# EAGLE design omca_to_mega_1 (EAGLE 7.6.0)
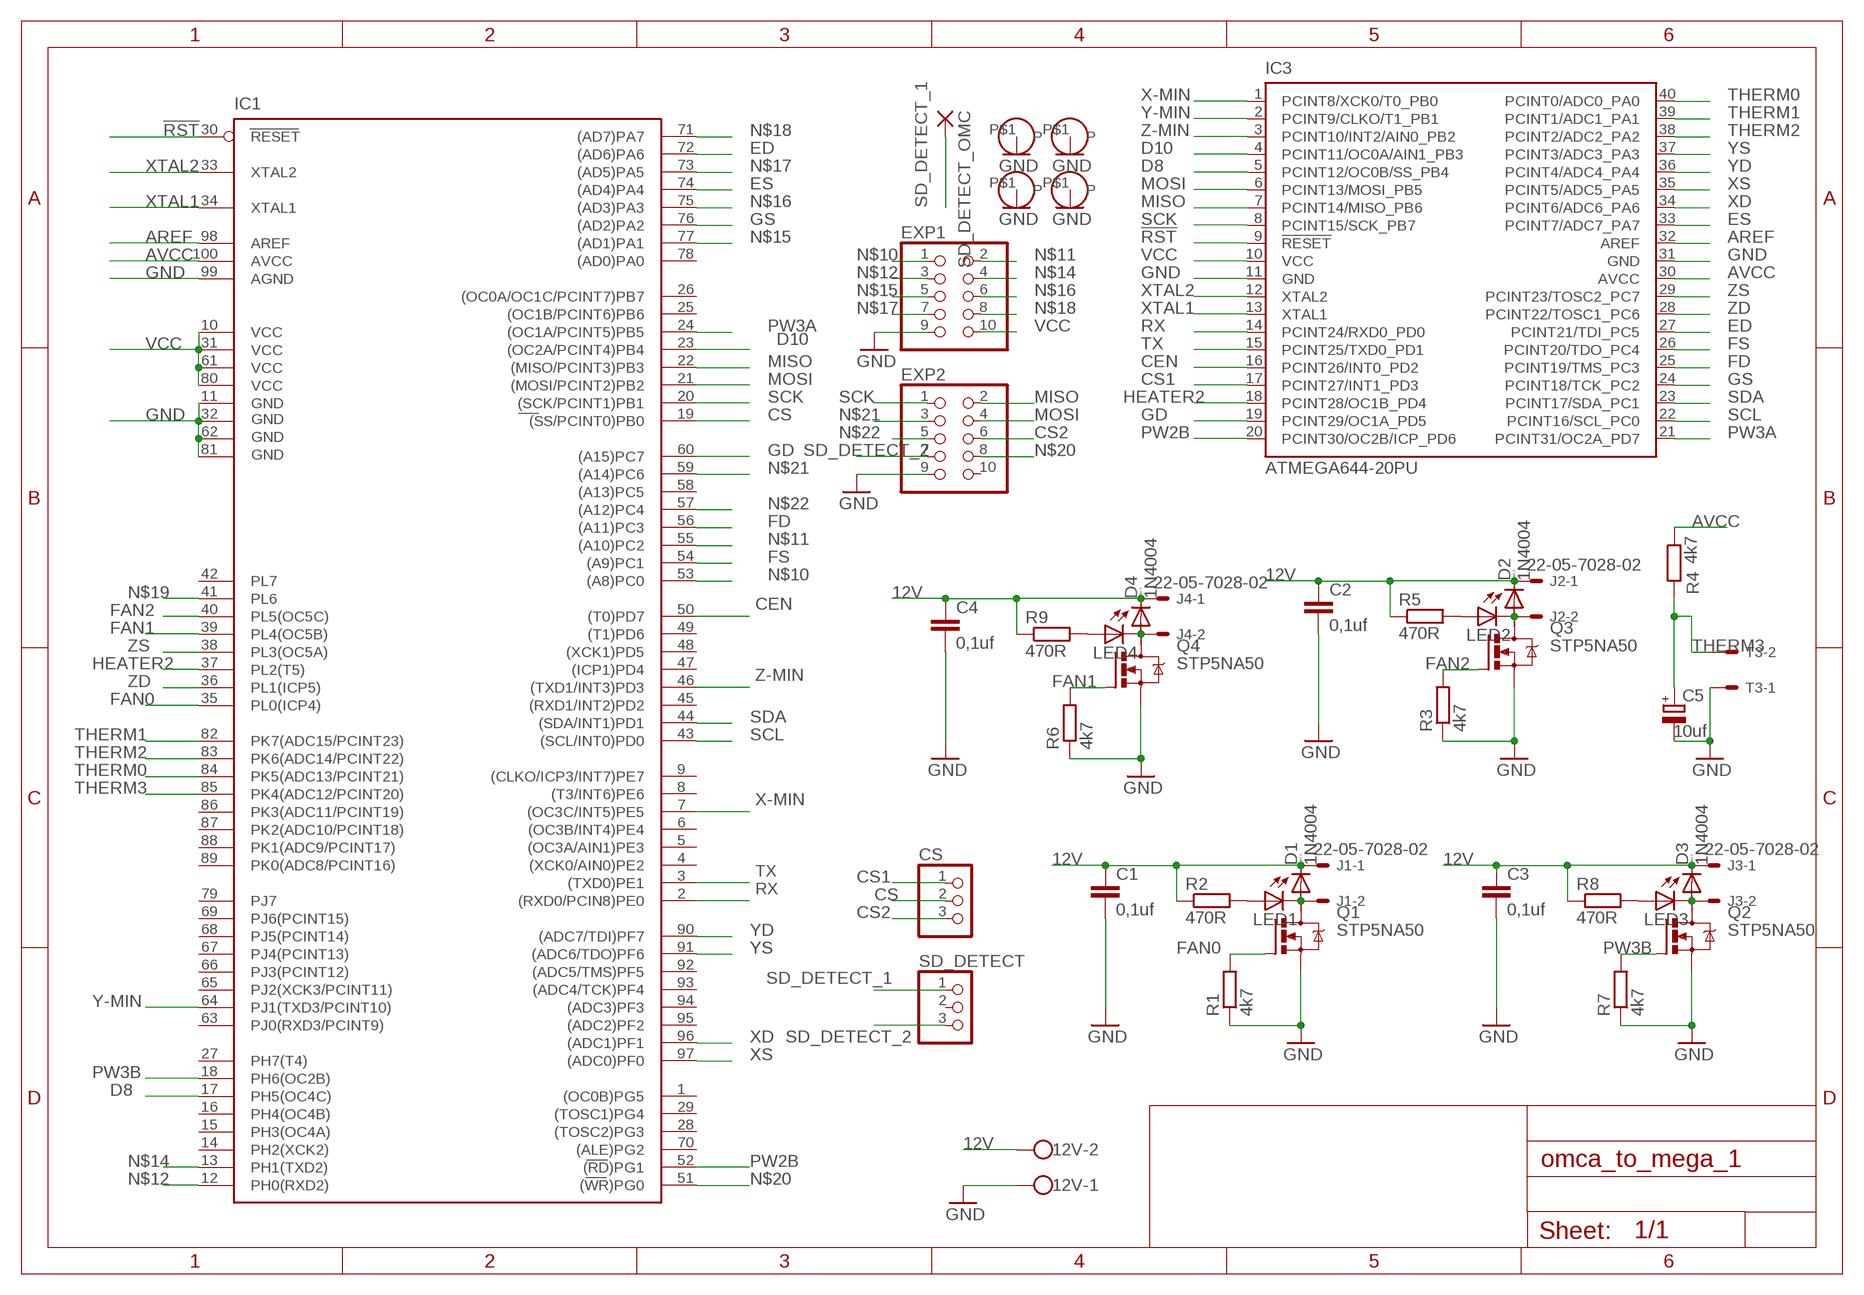
[diagram p0: schematic, sheet 1]

## Parts
12V  W237-102  [W237-102]
C1  0,1uf  C-EU025-024X044  [C025-024X044]
C2  0,1uf  C-EU025-024X044  [C025-024X044]
C3  0,1uf  C-EU025-024X044  [C025-024X044]
C4  0,1uf  C-EU025-024X044  [C025-024X044]
C5  10uf  CPOL-EUTT2D4  [TT2D4]
CS  PINHD-1X3  [1X03]
D1  1N4004  DIODE-D-7.5  [D-7.5]
D2  1N4004  DIODE-D-7.5  [D-7.5]
D3  1N4004  DIODE-D-7.5  [D-7.5]
D4  1N4004  DIODE-D-7.5  [D-7.5]
EXP1  PINHD-2X5  [2X05]
EXP2  PINHD-2X5  [2X05]
IC1  ATMEGA2560-16AU  ATMEGA25602560-16AU  [TQFP100]
IC3  ATMEGA644-20PU  [DIL40]
J1  22-05-7028-02  [7395-02]
J2  22-05-7028-02  [7395-02]
J3  22-05-7028-02  [7395-02]
J4  22-05-7028-02  [7395-02]
LED1  LED3MM  [LED3MM]
LED2  LED3MM  [LED3MM]
LED3  LED3MM  [LED3MM]
LED4  LED3MM  [LED3MM]
Q1  STP5NA50  [TO220BV]
Q2  STP5NA50  [TO220BV]
Q3  STP5NA50  [TO220BV]
Q4  STP5NA50  [TO220BV]
R1  4k7  R-EU_0204/7  [0204/7]
R2  470R  R-EU_0204/7  [0204/7]
R3  4k7  R-EU_0204/7  [0204/7]
R4  4k7  R-EU_0204/7  [0204/7]
R5  470R  R-EU_0204/7  [0204/7]
R6  4k7  R-EU_0204/7  [0204/7]
R7  4k7  R-EU_0204/7  [0204/7]
R8  470R  R-EU_0204/7  [0204/7]
R9  470R  R-EU_0204/7  [0204/7]
SD_DETECT  PINHD-1X3  [1X03]
SD_DETECT_OMC  1,6/0,8  [1,6/0,8]
T3  22-05-7028-02  [7395-02]
U$2  HOLE  [HOLE]
U$3  HOLE  [HOLE]
U$4  HOLE  [HOLE]
U$5  HOLE  [HOLE]

## Nets
12V: 12V.2 C1.1 C2.1 C3.1 C4.1 D1.C D2.C D3.C D4.C J1.1 J2.1 J3.1 J4.1 R2.1 R5.1 R8.1 R9.1
!RST: IC1.30(RESET) IC3.9(!RESET)
AREF: IC1.98(AREF) IC3.32(AREF)
AVCC: IC1.100(AVCC) IC3.30(AVCC) R4.1
CEN: IC1.50((T0)PD7) IC3.16(PCINT26/INT0_PD2)
CS: CS.2 IC1.19((SS/PCINT0)PB0)
CS1: CS.1 IC3.17(PCINT27/INT1_PD3)
CS2: CS.3 EXP2.6
D8: IC1.17(PH5(OC4C)) IC3.5(PCINT12/OC0B/SS_PB4)
D10: IC1.23((OC2A/PCINT4)PB4) IC3.4(PCINT11/OC0A/AIN1_PB3)
ED: IC1.72((AD6)PA6) IC3.27(PCINT21/TDI_PC5)
ES: IC1.74((AD4)PA4) IC3.33(PCINT7/ADC7_PA7)
FAN0: IC1.35(PL0(ICP4)) Q1.G R1.2
FAN1: IC1.39(PL4(OC5B)) Q4.G R6.2
FAN2: IC1.40(PL5(OC5C)) Q3.G R3.2
FD: IC1.56((A11)PC3) IC3.25(PCINT19/TMS_PC3)
FS: IC1.54((A9)PC1) IC3.26(PCINT20/TDO_PC4)
GD: IC1.60((A15)PC7) IC3.19(PCINT29/OC1A_PD5)
GND: 12V.1 C1.2 C2.2 C3.2 C4.2 C5.- EXP1.9 EXP2.9 IC1.11(GND) IC1.32(GND1) IC1.62(GND2) IC1.81(GND3) IC1.99(AGND) IC3.11(GND) IC3.31(GND) Q1.S Q2.S Q3.S Q4.S R1.1 R3.1 R6.1 R7.1 T3.1 U$2.P$1(P) U$3.P$1(P) U$4.P$1(P) U$5.P$1(P)
GS: IC1.76((AD2)PA2) IC3.24(PCINT18/TCK_PC2)
HEATER2: IC1.37(PL2(T5)) IC3.18(PCINT28/OC1B_PD4)
MISO: EXP2.2 IC1.22((MISO/PCINT3)PB3) IC3.7(PCINT14/MISO_PB6)
MOSI: EXP2.4 IC1.21((MOSI/PCINT2)PB2) IC3.6(PCINT13/MOSI_PB5)
N$2: D1.A J1.2 LED1.K(C) Q1.D
N$3: LED1.A R2.2
N$5: D2.A J2.2 LED2.K(C) Q3.D
N$6: LED2.A R5.2
N$8: D4.A J4.2 LED4.K(C) Q4.D
N$9: LED4.A R9.2
N$10: EXP1.1 IC1.53((A8)PC0)
N$11: EXP1.2 IC1.55((A10)PC2)
N$12: EXP1.3 IC1.12(PH0(RXD2))
N$13: D3.A J3.2 LED3.K(C) Q2.D
N$14: EXP1.4 IC1.13(PH1(TXD2))
N$15: EXP1.5 IC1.77((AD1)PA1)
N$16: EXP1.6 IC1.75((AD3)PA3)
N$17: EXP1.7 IC1.73((AD5)PA5)
N$18: EXP1.8 IC1.71((AD7)PA7)
N$19: IC1.41(PL6)
N$20: EXP2.8 IC1.51((WR)PG0)
N$21: EXP2.3 IC1.59((A14)PC6)
N$22: EXP2.5 IC1.57((A12)PC4)
N$52: LED3.A R8.2
PW2B: IC1.52((RD)PG1) IC3.20(PCINT30/OC2B/ICP_PD6)
PW3A: IC1.24((OC1A/PCINT5)PB5) IC3.21(PCINT31/OC2A_PD7)
PW3B: IC1.18(PH6(OC2B)) Q2.G R7.2
RX: IC1.2((RXD0/PCIN8)PE0) IC3.14(PCINT24/RXD0_PD0)
SCK: EXP2.1 IC1.20((SCK/PCINT1)PB1) IC3.8(PCINT15/SCK_PB7)
SCL: IC1.43((SCL/INT0)PD0) IC3.22(PCINT16/SCL_PC0)
SD_DETECT_1: SD_DETECT.1 SD_DETECT_OMC.1(P)
SD_DETECT_2: EXP2.7 SD_DETECT.3
SDA: IC1.44((SDA/INT1)PD1) IC3.23(PCINT17/SDA_PC1)
THERM0: IC1.84(PK5(ADC13/PCINT21)) IC3.40(PCINT0/ADC0_PA0)
THERM1: IC1.82(PK7(ADC15/PCINT23)) IC3.39(PCINT1/ADC1_PA1)
THERM2: IC1.83(PK6(ADC14/PCINT22)) IC3.38(PCINT2/ADC2_PA2)
THERM3: C5.+ IC1.85(PK4(ADC12/PCINT20)) R4.2 T3.2
TX: IC1.3((TXD0)PE1) IC3.15(PCINT25/TXD0_PD1)
VCC: EXP1.10 IC1.10(VCC) IC1.31(VCC1) IC1.61(VCC2) IC1.80(VCC3) IC3.10(VCC)
X-MIN: IC1.7((OC3C/INT5)PE5) IC3.1(PCINT8/XCK0/T0_PB0)
XD: IC1.96((ADC1)PF1) IC3.34(PCINT6/ADC6_PA6)
XS: IC1.97((ADC0)PF0) IC3.35(PCINT5/ADC5_PA5)
XTAL1: IC1.34(XTAL1) IC3.13(XTAL1)
XTAL2: IC1.33(XTAL2) IC3.12(XTAL2)
Y-MIN: IC1.64(PJ1(TXD3/PCINT10)) IC3.2(PCINT9/CLKO/T1_PB1)
YD: IC1.90((ADC7/TDI)PF7) IC3.36(PCINT4/ADC4_PA4)
YS: IC1.91((ADC6/TDO)PF6) IC3.37(PCINT3/ADC3_PA3)
Z-MIN: IC1.46((TXD1/INT3)PD3) IC3.3(PCINT10/INT2/AIN0_PB2)
ZD: IC1.36(PL1(ICP5)) IC3.28(PCINT22/TOSC1_PC6)
ZS: IC1.38(PL3(OC5A)) IC3.29(PCINT23/TOSC2_PC7)
Unconnected: EXP2.10 IC1.1((OC0B)PG5) IC1.4((XCK0/AIN0)PE2) IC1.5((OC3A/AIN1)PE3) IC1.6((OC3B/INT4)PE4) IC1.8((T3/INT6)PE6) IC1.9((CLKO/ICP3/INT7)PE7) IC1.14(PH2(XCK2)) IC1.15(PH3(OC4A)) IC1.16(PH4(OC4B)) IC1.25((OC1B/PCINT6)PB6) IC1.26((OC0A/OC1C/PCINT7)PB7) IC1.27(PH7(T4)) IC1.28((TOSC2)PG3) IC1.29((TOSC1)PG4) IC1.42(PL7) IC1.45((RXD1/INT2)PD2) IC1.47((ICP1)PD4) IC1.48((XCK1)PD5) IC1.49((T1)PD6) IC1.58((A13)PC5) IC1.63(PJ0(RXD3/PCINT9)) IC1.65(PJ2(XCK3/PCINT11)) IC1.66(PJ3(PCINT12)) IC1.67(PJ4(PCINT13)) IC1.68(PJ5(PCINT14)) IC1.69(PJ6(PCINT15)) IC1.70((ALE)PG2) IC1.78((AD0)PA0) IC1.79(PJ7) IC1.86(PK3(ADC11/PCINT19)) IC1.87(PK2(ADC10/PCINT18)) IC1.88(PK1(ADC9/PCINT17)) IC1.89(PK0(ADC8/PCINT16)) IC1.92((ADC5/TMS)PF5) IC1.93((ADC4/TCK)PF4) IC1.94((ADC3)PF3) IC1.95((ADC2)PF2) SD_DETECT.2

## Library data of the parts
12V = con-wago-500:W237-102: WAGO SCREW CLAMP; MPN: 237-102; OC_FARNELL: unknown; OC_NEWARK: 70K9898
C1-C4 = resistor:C-EU: CAPACITOR, European symbol; MF: VISHAY; MPN: K104K15X7RF53L2; OC_FARNELL: 1141775
C5 = rcl:CPOL-EU: POLARIZED CAPACITOR, European symbol; MF: RUBYCON; MPN: 100YXF10MEFC6.3X11; OC_FARNELL: 1144640
CS SD_DETECT = pinhead:PINHD-1X3: PIN HEADER
D1-D4 = diode:DIODE-: DIODE; MF: ON SEMICONDUCTOR; MPN: 1N4004RL; OC_FARNELL: 9556109
EXP1 EXP2 = pinhead:PINHD-2X5: PIN HEADER
IC1 = SmartPrj:ATMEGA2560: MICROCONTROLLER 64/128/256 Kbytes FLASH 4 Kbytes EEPROM 8 Kbytes SRAM 86 General Purpose I/O pins 12-channels16-bit PWM 4 x Serial USARTs 16-channels 10-bit A/D
IC3 = atmel:ATMEGA644-*PU: 8-bit Microcontroller with 64K Bytes In-System Programmable Flash Auto generated by make-symbol-device-package-bsdl.ulp Rev. 34 Source: http://www.atmel.com/dyn/resources/prod_documents/doc2593.pdf; MF: ATMEL; MPN: ATMEGA644-20PU; OC_FARNELL: 1288340; OC_NEWARK: 23M5060
J1-J4 T3 = con-molex:22-?-02: CONNECTOR wire to board 2.54 mm (.1 inch) pitch header; MF: MOLEX; MPN: 22-05-7028; OC_FARNELL: 9731601; OC_NEWARK: unknown
LED1-LED4 = led:LED: LED OSRAM: - CHIPLED LG R971, LG N971, LY N971, LG Q971, LY Q971, LO R971, LY R971 LH N974, LH R974 LS Q976, LO Q976, LY Q976 LO Q996 - Hyper CHIPLED LW Q18S LB Q993, LB Q99A, LB R99A - SideLED LS A670, LO A670, LY A670, LG A670, LP A670 LB A673, LV A673, LT A673, LW A673 LH A674 LY A675 LS A676, LA A676, LO A676, LY A676, LW A676 LS A679, LY A679, LG A679 - Hyper Micro SIDELED® LS Y876, LA Y876, LO Y876, LY Y876 LT Y87S - SmartLED LW L88C, LW L88S LB L89C, LB L89S, LG L890 LS L89K, LO L89K, LY L89K LS L896, LA L896, LO L896, LY L896 - TOPLED LS T670, LO T670, LY T670, LG T670, LP T670 LSG T670, LSP T670, LSY T670, LOP T670, LYG T670 LG T671, LOG T671, LSG T671 LB T673, LV T673, LT T673, LW T673 LH T674 LS T676, LA T676, LO T676, LY T676, LB T676, LH T676, LSB T676, LW T676 LB T67C, LV T67C, LT T67C, LS T67K, LO T67K, LY T67K, LW E67C LS E67B, LA E67B, LO E67B, LY E67B, LB E67C, LV E67C, LT E67C LW T67C LS T679, LY T679, LG T679 LS T770, LO T770, LY T770, LG T770, LP T770 LB T773, LV T773, LT T773, LW T773 LH T774 LS E675, LA E675, LY E675, LS T675 LS T776, LA T776, LO T776, LY T776, LB T776 LHGB T686 LT T68C, LB T68C - Hyper Mini TOPLED® LB M676 - Mini TOPLED Santana® LG M470 LS M47K, LO M47K, LY M47K Source: http://www.osram.convergy.de LUXEON: - LUMILED® LXK2-PW12-R00, LXK2-PW12-S00, LXK2-PW14-U00, LXK2-PW14-V00 LXK2-PM12-R00, LXK2-PM12-S00, LXK2-PM14-U00 LXK2-PE12-Q00, LXK2-PE12-R00, LXK2-PE12-S00, LXK2-PE14-T00, LXK2-PE14-U00 LXK2-PB12-K00, LXK2-PB12-L00, LXK2-PB12-M00, LXK2-PB14-N00, LXK2-PB14-P00, LXK2-PB14-Q00 LXK2-PR12-L00, LXK2-PR12-M00, LXK2-PR14-Q00, LXK2-PR14-R00 LXK2-PD12-Q00, LXK2-PD12-R00, LXK2-PD12-S00 LXK2-PH12-R00, LXK2-PH12-S00 LXK2-PL12-P00, LXK2-PL12-Q00, LXK2-PL12-R00 Source: www.luxeon.com KINGBRIGHT: KA-3528ASYC Source: www.kingbright.com; MF: KINGBRIGHT; MPN: L-93WEYW; OC_FARNELL: 1142521
Q1-Q4 = transistor-power:STP5NA50: N-CHANNEL MOS FET; MF: STMICROELECTRONICS; MPN: STP55NF06L.; OC_FARNELL: 1783902
R1 R3 R6 R7 = resistor:R-EU_: RESISTOR, European symbol; MF: WELWYN; MPN: MFR4 10K 1%; OC_FARNELL: 1099988
R2 R5 R8 R9 = resistor:R-EU_: RESISTOR, European symbol; MF: WELWYN; MPN: MFR4 470R 1%; OC_FARNELL: 1099883
R4 = rcl:R-EU_: RESISTOR, European symbol; MF: WELWYN; MPN: MFR4 4K7 1%; OC_FARNELL: 1099979
SD_DETECT_OMC = wirepad:1,6/0,8: THROUGH-HOLE PAD
U$2-U$5 = amino:HOLE; OC_FARNELL: unknown

## Net classes
0 default: width 0.61 mm

## Board
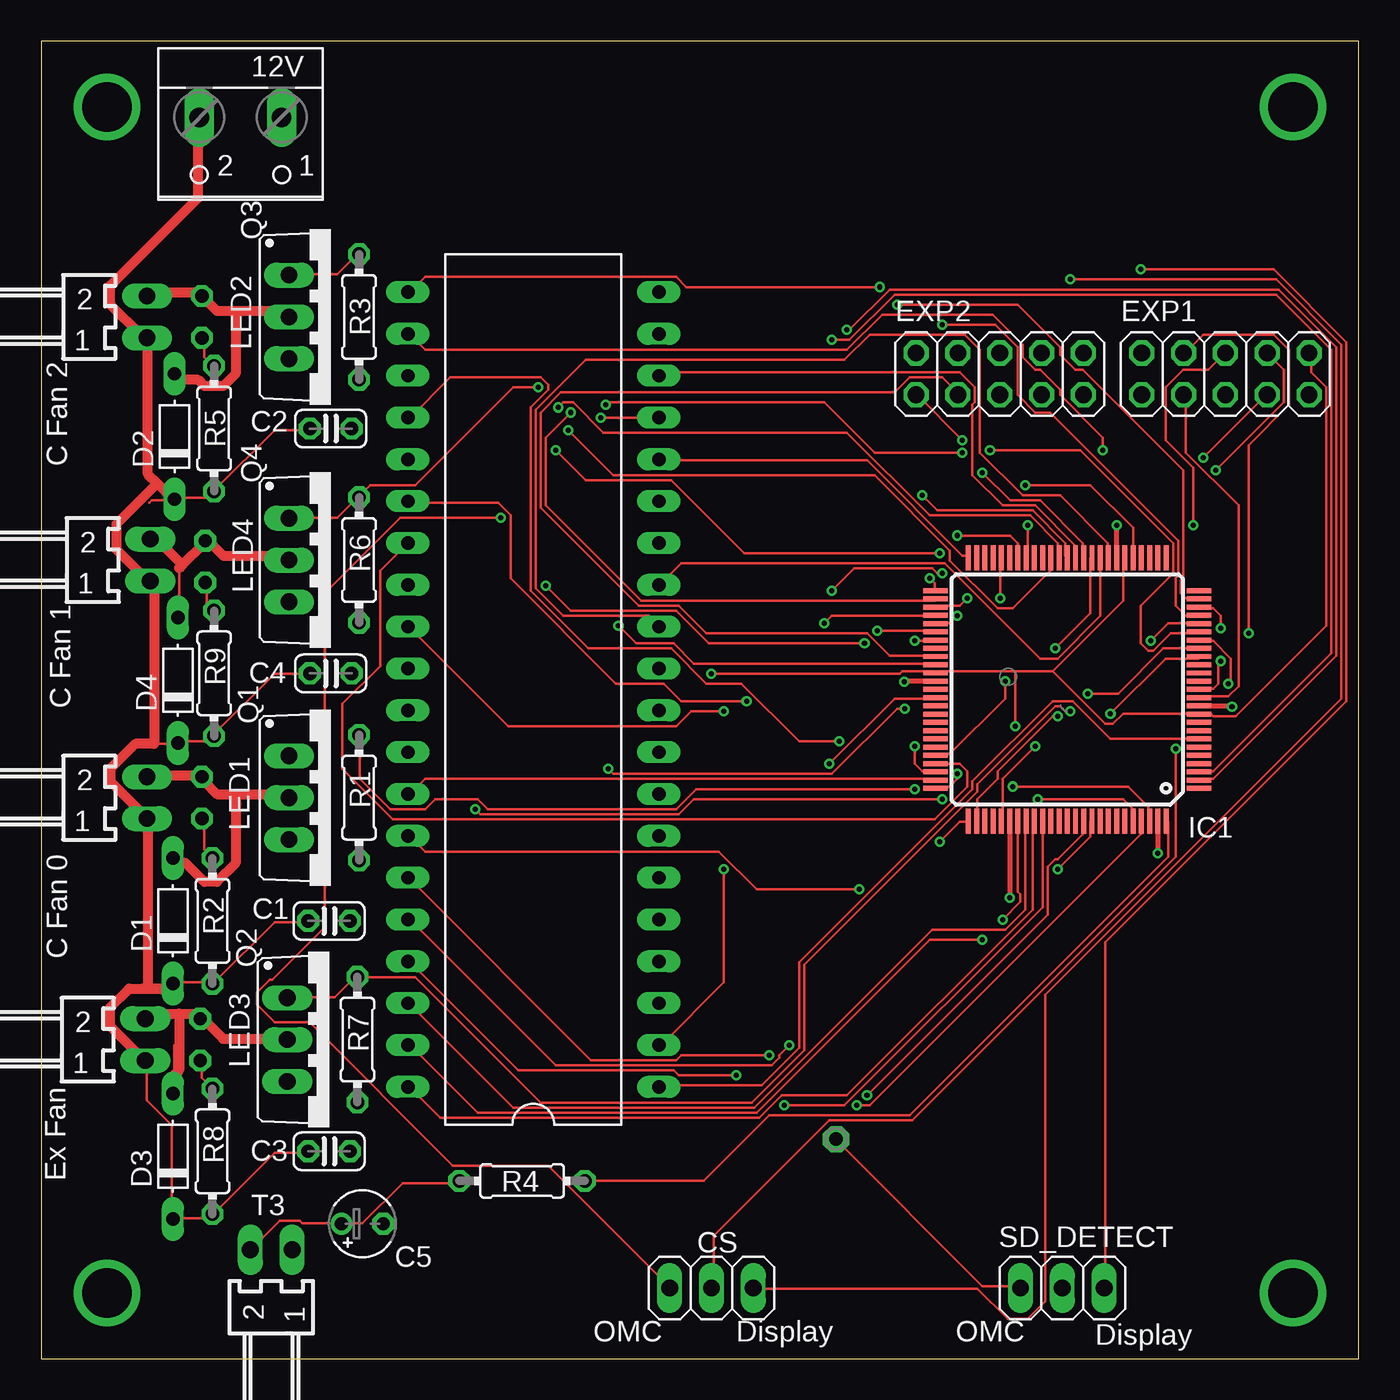
[diagram p1: board, top side]
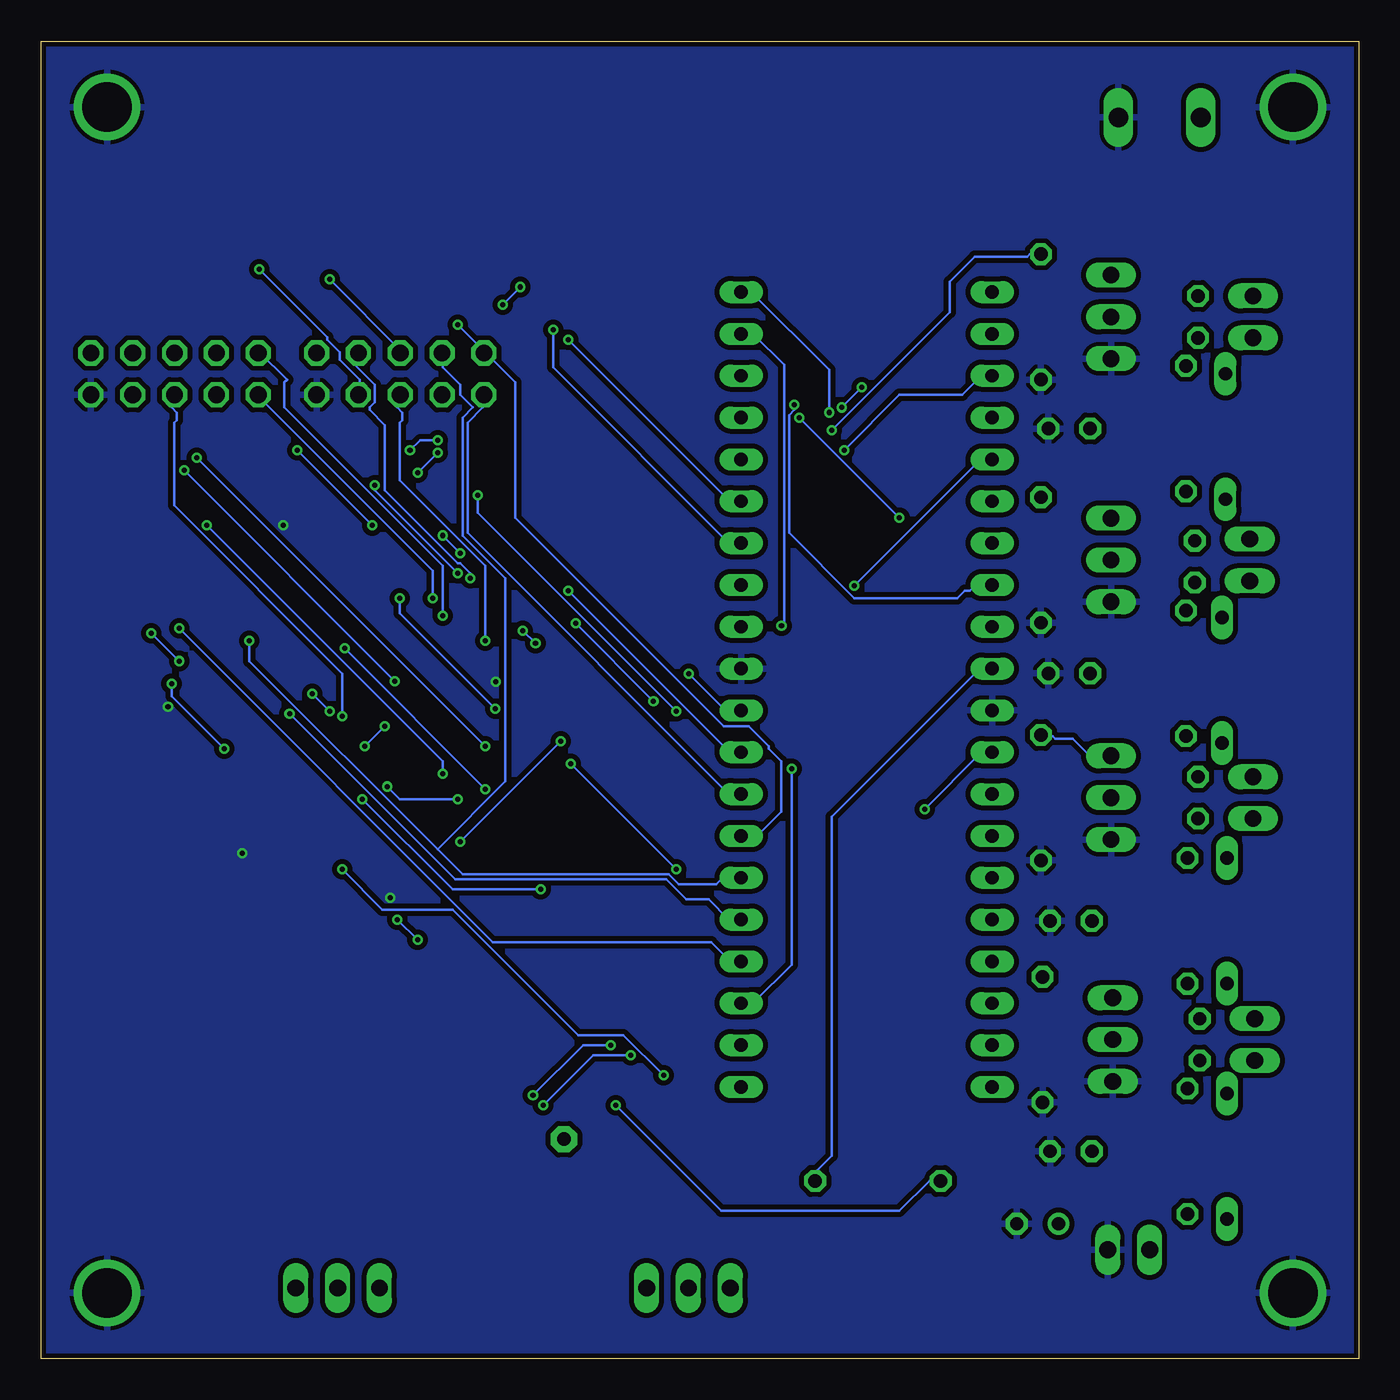
[diagram p2: board, bottom side, seen from below]

Size 80 x 80 mm. Coordinates in mm from the lower left corner, seen from the top.
Outline: 0,0 80,0 80,80 0,80 0,0
Copper layers (1*16): Top 0.035mm / dielectric 1.5mm / Bottom 0.035mm
Design rules "default *": minimum track width 6mil, minimum drill 12mil, track to track 6mil, track to pad 6mil, pad to pad 6mil, via to via 6mil, smd to smd 0mil, copper to edge 10mil, drill to drill 10mil, minimum pad ring 10mil, minimum via ring 6mil, stop-mask expansion 2mil, vias tented up to drill 100mil, thermal gap 10mil

### Footprints (pad centres in the part's own frame; a part is rotated, then mirrored left to right if it is on the bottom)
W237-102 = drill 1.194 long: 1 -2.5,-1.27; 2 2.5,-1.27
C025-024X044 = drill 0.813 octagon: 1 -1.27,0; 2 1.27,0
TT2D4 = drill 0.813: + -1.27,0 | drill 0.813 octagon: - 1.27,0
1X03 = drill 1.016 long: 1 -2.54,0; 2 0,0; 3 2.54,0
D-7.5 = drill 0.813 long: A 3.81,0; C -3.81,0
2X05 = drill 1.016 octagon: 1 -5.08,-1.27; 2 -5.08,1.27; 3 -2.54,-1.27; 4 -2.54,1.27; 5 0,-1.27; 6 0,1.27; 7 2.54,-1.27; 8 2.54,1.27; 9 5.08,-1.27; 10 5.08,1.27
TQFP100 = smd 1.5 x 0.3: 1 -8,6; 2 -8,5.5; 3 -8,5; 4 -8,4.5; 5 -8,4; 6 -8,3.5; 7 -8,3; 8 -8,2.5; 9 -8,2; 10 -8,1.5; 11 -8,1; 12 -8,0.5; 13 -8,0; 14 -8,-0.5; 15 -8,-1; 16 -8,-1.5; 17 -8,-2; 18 -8,-2.5; 19 -8,-3; 20 -8,-3.5; 21 -8,-4; 22 -8,-4.5; 23 -8,-5; 24 -8,-5.5; 25 -8,-6; 51 8,-6; 52 8,-5.5; 53 8,-5; 54 8,-4.5; 55 8,-4; 56 8,-3.5; 57 8,-3; 58 8,-2.5; 59 8,-2; 60 8,-1.5; 61 8,-1; 62 8,-0.5; 63 8,0; 64 8,0.5; 65 8,1; 66 8,1.5; 67 8,2; 68 8,2.5; 69 8,3; 70 8,3.5; 71 8,4; 72 8,4.5; 73 8,5; 74 8,5.5; 75 8,6 | smd 0.3 x 1.5: 26 -6,-8; 27 -5.5,-8; 28 -5,-8; 29 -4.5,-8; 30 -4,-8; 31 -3.5,-8; 32 -3,-8; 33 -2.5,-8; 34 -2,-8; 35 -1.5,-8; 36 -1,-8; 37 -0.5,-8; 38 0,-8; 39 0.5,-8; 40 1,-8; 41 1.5,-8; 42 2,-8; 43 2.5,-8; 44 3,-8; 45 3.5,-8; 46 4,-8; 47 4.5,-8; 48 5,-8; 49 5.5,-8; 50 6,-8; 76 6,8; 77 5.5,8; 78 5,8; 79 4.5,8; 80 4,8; 81 3.5,8; 82 3,8; 83 2.5,8; 84 2,8; 85 1.5,8; 86 1,8; 87 0.5,8; 88 0,8; 89 -0.5,8; 90 -1,8; 91 -1.5,8; 92 -2,8; 93 -2.5,8; 94 -3,8; 95 -3.5,8; 96 -4,8; 97 -4.5,8; 98 -5,8; 99 -5.5,8; 100 -6,8
DIL40 = drill 0.813 long: 1 -24.13,-7.62; 2 -21.59,-7.62; 3 -19.05,-7.62; 4 -16.51,-7.62; 5 -13.97,-7.62; 6 -11.43,-7.62; 7 -8.89,-7.62; 8 -6.35,-7.62; 9 -3.81,-7.62; 10 -1.27,-7.62; 11 1.27,-7.62; 12 3.81,-7.62; 13 6.35,-7.62; 14 8.89,-7.62; 15 11.43,-7.62; 16 13.97,-7.62; 17 16.51,-7.62; 18 19.05,-7.62; 19 21.59,-7.62; 20 24.13,-7.62; 21 24.13,7.62; 22 21.59,7.62; 23 19.05,7.62; 24 16.51,7.62; 25 13.97,7.62; 26 11.43,7.62; 27 8.89,7.62; 28 6.35,7.62; 29 3.81,7.62; 30 1.27,7.62; 31 -1.27,7.62; 32 -3.81,7.62; 33 -6.35,7.62; 34 -8.89,7.62; 35 -11.43,7.62; 36 -13.97,7.62; 37 -16.51,7.62; 38 -19.05,7.62; 39 -21.59,7.62; 40 -24.13,7.62
7395-02 = drill 1.016 long: 1 1.27,0; 2 -1.27,0
LED3MM = drill 0.813 octagon: A -1.27,0; K 1.27,0
TO220BV = drill 1.016 long: D 0,-2.54; G -2.54,-2.54; S 2.54,-2.54
0204/7 = drill 0.813 octagon: 1 -3.81,0; 2 3.81,0
1,6/0,8 = drill 0.813 pad 1.6 octagon: 1 0,0
HOLE = drill 3: P$1 0,0

### Placement (x,y rotation side)
12V  12.1,74.1 180 top
C1  17.48,26.59 0 top
C2  17.58,56.48 0 top
C3  17.48,12.6 0 top
C4  17.58,41.62 0 top
C5  19.5,8.2 0 top
CS  40.7,4.3 0 top
D1  8,26.59 90 top
D2  8.1,56 90 top
D3  8,12.3 90 top
D4  8.3,41.2 90 top
EXP1  71.9,59.8 0 top
EXP2  58.2,59.8 0 top
IC1  62.3,40.64 180 top
IC3  29.88,40.64 90 top
J1  6.42,34.07 270 top
J2  6.42,63.26 270 top
J3  6.32,19.38 270 top
J4  6.62,48.5 270 top
LED1  9.76,34.07 90 top
LED2  9.76,63.26 90 top
LED3  9.66,19.38 90 top
LED4  9.96,48.4 90 top
Q1  17.58,34.07 270 top
Q2  17.48,19.38 270 top
Q3  17.58,63.26 270 top
Q4  17.58,48.5 270 top
R1  19.3,34.07 90 top
R2  10.4,26.59 90 top
R3  19.3,63.26 90 top
R4  29.2,10.8 180 top
R5  10.5,56.48 90 top
R6  19.3,48.5 90 top
R7  19.2,19.38 90 top
R8  10.4,12.6 90 top
R9  10.5,41.62 90 top
SD_DETECT  62,4.3 0 top
SD_DETECT_OMC  48.26,13.34 0 top
T3  13.97,6.62 0 top
U$2  4,4 0 top
U$3  4,76 0 top
U$4  76,76 0 top
U$5  76,4 0 top

### Tracks (layer width: path | path; a pad name or v marks a point on that pad's centre or on a via)
12V
  Top 0.152: C3.1 16.15,12.5 14.17,12.5 10.52,8.84 R8.1 10.36,8.69 10.21,8.53 8.08,8.53 D3.C 7.92,8.53 7.92,14.17 6.4,15.7 6.4,17.98 J3.1 6.25,18.14 | C1.1 16.15,26.52 14.17,26.52 10.52,22.86 R2.1 10.36,22.86 8.08,22.86 D1.C 7.92,22.71 6.1,22.71 | C4.1 16.31,41.6 14.17,41.6 10.52,37.95 R9.1 10.36,37.8 10.06,37.49 8.38,37.49 D4.C 8.23,37.34 6.86,37.34 6.71,37.34 | C2.1 16.31,56.39 14.17,56.39 10.52,52.73 R5.1 10.36,52.58 10.06,52.27 8.23,52.27 D2.C 8.08,52.12 6.71,52.12 6.55,51.97
  Top 0.61: 6.48,22.48 5.33,22.48 4.19,21.34 4.19,20.19 6.1,18.29 J3.1 | 6.48,22.48 7.62,22.48 D1.C | 7.05,53.15 8,52.2 D2.C | 7.05,53.15 6.48,53.72 6.48,61.72 J2.1 6.1,62.1 4.19,64.01 4.19,65.15 9.53,70.48 9.53,75.06 12V.2 | 7.05,53.15 4.57,50.67 4.57,49.15 6.48,47.24 J4.1 6.86,46.86 6.86,37.34 5.71,37.34 4.19,35.81 4.19,35.05 6.1,33.15 J1.1 6.48,32.77 6.48,22.48
!RST  (via drill 0.3)
  Top 0.152: v59.74,53.03 63.7,53.03 66.29,50.44 66.29,48.77 IC1.30 | v54.71,47.7 54.41,47.7 54.1,48.01 49.38,48.01 v48.01,46.63
  Bottom 0.152: v59.74,53.03 59.74,52.73 v54.71,47.7 | v48.01,46.63 38.25,36.88 37.64,36.88 IC3.9
AREF  (via drill 0.3)
  Top 0.152: v58.98,34.75 65.99,34.75 67.21,33.53 67.21,32.77 IC1.98 | v54.71,33.98 39.62,33.98 38.71,33.07 26.67,33.07 v26.36,33.38
  Bottom 0.152: v58.98,34.75 58.22,33.98 v54.71,33.98 | v26.36,33.38 23.01,36.73 22.4,36.73 IC3.32
AVCC
  Top 0.152: IC1.100 68.43,32.61 68.43,30.48 52.73,14.78 44.2,14.78 40.23,10.82 33.07,10.82 R4.1
  Bottom 0.152: IC3.30 23.01,41.91 32,32.92 32,12.34 32.92,11.43 32.92,10.82 R4.1
CEN
  Top 0.152: IC1.50 56.24,48.77 55.93,48.77 50.14,54.56 37.64,54.56 IC3.16
CS  (via drill 0.3)
  Top 0.152: v72.08,41 72.24,41.15 72.24,42.52 71.17,43.59 70.41,43.59 IC1.19 | v68.89,37.03 68.89,30.48 52.88,14.48 47.85,14.48 40.84,7.47 40.84,4.42 CS.2
  Bottom 0.152: v72.08,41 72.08,40.23 v68.89,37.03
CS1  (via drill 0.3)
  Top 0.152: v33.98,57.15 IC3.17 | v27.89,51.05 21.79,51.05 17.22,46.48 17.22,26.21 14.02,23.01 13.87,23.01 13.11,22.25 13.11,21.49 14.17,20.42 16.31,20.42 24.99,11.73 30.79,11.73 38.1,4.42 CS.1
  Bottom 0.152: v27.89,51.05 v33.98,57.15
CS2  (via drill 0.3)
  Top 0.152: v62.48,65.53 74.98,65.53 78.94,61.57 78.94,40.08 60.96,22.1 60.96,3.5 59.89,2.44 58.67,2.44 56.84,4.27 43.28,4.27 CS.3
  Bottom 0.152: v62.48,65.53 58.06,61.11 EXP2.6
D8  (via drill 0.3)
  Top 0.152: v64.92,39.17 68.28,42.52 70.26,42.52 IC1.17
  Bottom 0.152: v64.92,39.17 54.86,29.11 42.06,29.11 40.84,27.89 39.47,27.89 38.25,26.67 IC3.5
D10  (via drill 0.3)
  Top 0.152: v71.63,44.35 71.63,45.11 71.17,45.57 70.41,45.57 IC1.23
  Bottom 0.152: v71.63,44.35 52.58,25.3 39.32,25.3 38.25,24.23 37.64,24.23 IC3.4
ED
  Top 0.152: IC1.72 54.41,36.12 55.78,36.12 56.24,35.66 56.24,34.75 54.25,32.77 21.34,32.77 18.29,35.81 18.29,39.78 20.57,42.06 20.57,47.85 IC3.27
ES
  Top 0.152: IC1.74 54.25,35.2 23.32,35.2 22.4,34.29 IC3.33
FAN0  (via drill 0.3)
  Top 0.152: v61.57,43.13 63.7,45.26 63.7,48.62 IC1.35 | v53.03,34.59 39.78,34.59 38.56,33.38 27.13,33.38 26.52,33.98 23.93,33.98 23.32,33.38 21.18,33.38 19.36,35.2 19.36,37.8 R1.2
  Bottom 0.152: v53.03,34.59 v61.57,43.13 | Q1.G 15.09,36.73 16.46,36.73 17.37,37.64 18.44,37.64 18.59,37.8 19.2,37.8 R1.2
FAN1  (via drill 0.3)
  Top 0.152: v31.39,57.76 31.7,58.06 32.31,58.06 34.14,56.24 48.92,56.24 53.95,51.21 60.05,51.21 61.72,49.53 61.72,48.77 IC1.39 | v30.18,58.98 28.65,58.98 22.71,53.03 19.96,53.03 19.36,52.43 R6.2 19.2,52.27 17.98,51.05 15.09,51.05 Q4.G
  Bottom 0.152: v30.18,58.98 v31.39,57.76
FAN2  (via drill 0.3)
  Top 0.152: v32,56.39 34.75,53.65 50.6,53.65 55.17,49.07 55.17,48.46 58.06,45.57 58.98,45.57 61.27,47.85 61.27,48.62 IC1.40 | Q3.G 15.09,65.84 17.98,65.84 19.2,67.06 R3.2
  Bottom 0.152: v32,56.39 24.84,63.55 24.84,65.38 23.32,66.9 20.12,66.9 19.96,67.06 19.36,67.06 R3.2
FD  (via drill 0.3)
  Top 0.152: v50.75,44.2 54.25,44.2 IC1.56 | v49.99,43.43 40.54,43.43 38.56,45.41 32.16,45.41 v30.63,46.94
  Bottom 0.152: v49.99,43.43 v50.75,44.2 | v30.63,46.94 23.01,54.56 22.4,54.56 IC3.25
FS  (via drill 0.3)
  Top 0.152: v47.55,44.65 48.01,45.11 54.25,45.11 IC1.54 | v42.82,39.93 38.86,39.93 37.8,41 34.9,41 28.5,47.4 28.5,51.21 27.74,51.97 22.4,51.97 IC3.26
  Bottom 0.152: v42.82,39.93 v47.55,44.65
GD  (via drill 0.3)
  Top 0.152: v35.05,44.5 36.12,43.43 38.41,43.43 39.62,42.22 54.25,42.22 IC1.60
  Bottom 0.152: v35.05,44.5 34.9,44.65 34.9,60.35 36.73,62.18 37.49,62.18 IC3.19
GND  (via drill 0.3)
  Top 0.305: IC1.62 52.4,41.14 | IC1.81 v58.8,28 | IC1.99 v67.8,30.7 | IC1.11 72.3,39.64 | IC1.32 v65.3,50.6
  Top 0.406: 52.4,41.14 v52.4,41.1 | 72.3,39.64 v72.3,39.6
  pour Bottom (isolate 0.305): 0,80 80,80 80,0 0,0
GS  (via drill 0.3)
  Top 0.152: v54.56,31.39 55.78,32.61 56.24,32.61 IC1.76 | v48.46,37.49 46.02,37.49 42.52,41 40.39,41 38.25,43.13 33.22,43.13 29.72,46.63 29.72,57.76 30.79,58.83 30.79,59.13 30.33,59.59 24.84,59.59 22.4,57.15 IC3.24
  Bottom 0.152: v48.46,37.49 v54.56,31.39
HEATER2
  Top 0.152: IC1.37 62.79,48.77 62.79,49.38 60.35,51.82 58.37,51.82 56.54,53.65 56.54,57.91 56.69,58.06 56.69,58.98 55.78,59.89 37.8,59.89 37.64,59.74 IC3.18
MISO  (via drill 0.3)
  Top 0.152: v54.71,62.79 57.91,62.79 59.28,61.42 59.28,58.52 60.35,57.45 61.27,57.45 69.04,49.68 69.04,47.55 68.89,47.4 68.89,45.72 69.49,45.11 70.26,45.11 IC1.22
  Bottom 0.152: 53.03,61.11 v54.71,62.79 | 53.03,61.11 51.21,59.28 51.21,51.05 38.56,38.41 37.03,38.41 35.81,37.19 35.81,37.03 35.05,36.27 35.05,33.22 36.42,31.85 37.49,31.85 IC3.7 | 53.03,61.11 EXP2.2
MOSI  (via drill 0.3)
  Top 0.152: v67.36,43.59 68.43,44.65 70.26,44.65 IC1.21
  Bottom 0.152: v67.36,43.59 67.36,42.37 55.93,30.94 | 55.93,30.94 54.41,29.41 41.91,29.41 41.3,28.8 39.01,28.8 38.71,29.11 37.64,29.11 IC3.6 | 55.93,30.94 51.82,35.05 51.82,47.4 54.41,49.99 54.41,57.15 53.8,57.76 54.56,58.52 54.56,59.13 55.63,60.2 55.63,60.96 EXP2.4
N$2
  Top 0.152: 8.08,30.48 D1.A
  Top 0.61: J1.2 6.48,35.43 9.53,35.43 LED1.K 9.91,35.05 10.67,34.29 11.81,34.29 | 11.81,34.29 14.86,34.29 Q1.D | 11.81,34.29 11.81,30.1 10.67,28.96 9.91,28.96 8.76,30.1 8,30.1 D1.A
N$3
  Top 0.152: LED1.A 9.91,32.77 9.91,30.94 10.36,30.48 R2.2
N$5
  Top 0.152: 8.23,59.89 D2.A
  Top 0.61: J2.2 6.48,64.77 9.53,64.77 LED2.K 9.91,64.39 10.67,63.63 11.81,63.63 | 11.81,63.63 14.86,63.63 Q3.D | 11.81,63.63 11.81,59.82 11.05,59.05 9.91,59.05 9.53,59.44 8.38,59.44 D2.A
N$6
  Top 0.152: LED2.A 9.91,61.87 9.91,60.81 10.36,60.35 R5.2
N$8
  Top 0.152: 8.38,48.01 8.38,45.11 D4.A
  Top 0.61: 8.38,48.01 8.57,48.2 | 8.57,48.2 9.91,49.53 LED4.K 10.29,49.53 11.05,48.77 14.86,48.77 Q4.D | 8.57,48.2 6.86,49.91 J4.2
N$9
  Top 0.152: LED4.A 10.06,47.09 10.06,45.87 10.36,45.57 R9.2
N$10  (via drill 0.3)
  Top 0.152: v56.24,46.18 55.78,45.72 54.41,45.72 IC1.53
  Bottom 0.152: v56.24,46.18 56.24,47.85 66.9,58.52 EXP1.1
N$11  (via drill 0.3)
  Top 0.152: v55.63,45.11 55.17,44.65 54.41,44.65 IC1.55
  Bottom 0.152: v55.63,45.11 55.63,48.16 65.23,57.76 65.23,59.28 65.08,59.44 66.75,61.11 EXP1.2
N$12
  Top 0.152: IC1.12 70.41,40.23 72.08,40.23 72.69,40.84 72.69,51.82 69.49,55.02 69.49,58.52 EXP1.3
N$13
  Top 0.152: 8.08,19.05 8.08,16.15 D3.A
  Top 0.61: 8.38,20.95 6.48,20.95 J3.2 | 8.38,20.95 9.53,20.95 LED3.K 9.91,20.57 11.05,19.43 14.86,19.43 Q2.D | 8.38,20.95 8.38,17.53 8,17.14 8,16.38 D3.A
N$14  (via drill 0.3)
  Top 0.152: v71.63,42.37 71.48,42.22 71.48,41 71.17,40.69 70.41,40.69 IC1.13 | v73.3,44.04 73.3,55.47 75.74,57.91 75.74,61.27 74.83,62.18 70.56,62.18 69.49,61.11 EXP1.4
  Bottom 0.152: v73.3,44.04 v71.63,42.37
N$15  (via drill 0.3)
  Top 0.152: v61.72,39.01 61.42,39.01 58.06,35.66 58.06,35.2 56.84,33.98 56.84,32.77 IC1.77
  Bottom 0.152: v61.72,39.01 61.72,41.6 71.93,51.82 71.93,56.84 71.78,57 71.78,57.45 72.08,57.76 72.08,58.37 71.93,58.52 EXP1.5
N$16  (via drill 0.3)
  Top 0.152: v55.63,35.51 55.63,35.2 55.17,34.75 54.41,34.75 IC1.75 | v69.95,50.6 69.95,54.1 68.28,55.78 68.28,58.98 69.34,60.05 70.87,60.05 71.78,60.96 EXP1.6
  Bottom 0.152: v55.63,35.51 55.63,36.27 v69.95,50.6
N$17  (via drill 0.3)
  Top 0.152: v53.03,37.19 53.03,36.12 53.49,35.66 54.25,35.66 IC1.73 | v70.56,54.71 74.37,58.52 EXP1.7
  Bottom 0.152: v70.56,54.71 v53.03,37.19
N$18  (via drill 0.3)
  Top 0.152: v58.52,41.15 58.52,40.08 55.17,36.73 54.41,36.73 IC1.71 | v71.32,53.95 75.44,58.06 75.44,60.05 74.52,60.96 EXP1.8
  Bottom 0.152: v71.32,53.95 v58.52,41.15
N$20  (via drill 0.3)
  Top 0.152: v53.95,47.4 54.25,47.09 54.25,46.79 IC1.51
  Bottom 0.152: v53.95,47.4 53.95,47.7 54.56,48.31 54.71,48.31 59.13,52.73 59.13,56.69 60.05,57.61 60.05,57.76 59.74,58.06 59.74,59.13 60.96,60.35 60.96,60.81 60.81,60.96 EXP2.8
N$21
  Top 0.152: IC1.59 54.25,42.67 51.51,42.67 50.14,44.04 40.39,44.04 38.71,45.72 36.27,45.72 30.33,51.66 30.33,57.45 31.55,58.67 51.82,58.67 52.73,59.59 54.71,59.59 55.63,58.67 EXP2.3
N$22  (via drill 0.3)
  Top 0.152: v53.03,43.59 54.25,43.59 IC1.57
  Bottom 0.152: v53.03,43.59 53.03,48.16 58.22,53.34 58.22,56.84 58.06,57 58.06,57.45 58.37,57.76 58.37,58.37 58.22,58.52 EXP2.5
N$52
  Top 0.152: LED3.A 9.75,17.98 9.75,17.07 10.36,16.46 R8.2
PW2B  (via drill 0.3)
  Top 0.152: v32.16,57.45 30.63,55.93 30.63,51.82 36.42,46.02 54.25,46.02 IC1.52
  Bottom 0.152: v32.16,57.45 32.16,60.05 36.88,64.77 IC3.20
PW3A  (via drill 0.3)
  Top 0.152: v51.97,64.01 59.28,64.01 61.87,61.42 61.87,60.96 62.79,60.05 63.25,60.05 69.34,53.95 69.34,47.4 69.19,47.24 69.19,46.48 69.49,46.18 70.26,46.18 IC1.24 | v50.9,65.08 39.17,65.08 38.56,65.68 23.32,65.68 22.4,64.77 IC3.21
  Bottom 0.152: v50.9,65.08 v51.97,64.01
PW3B  (via drill 0.3)
  Top 0.152: v63.55,40.39 65.38,40.39 68.12,43.13 70.26,43.13 IC1.18 | v62.48,39.32 62.18,39.32 61.87,39.62 61.57,39.62 56.84,34.9 56.84,34.44 46.33,23.93 46.33,18.75 43.13,15.54 30.33,15.54 22.71,23.16 19.2,23.16 R7.2 19.05,23.16 17.83,21.95 15.09,21.95 Q2.G
  Bottom 0.152: v62.48,39.32 v63.55,40.39
RX  (via drill 0.3)
  Top 0.152: v48.92,62.48 49.07,62.48 51.51,64.92 75.13,64.92 78.64,61.42 78.64,42.67 71.17,35.2 70.41,35.2 IC1.2
  Bottom 0.152: v48.92,62.48 48.92,60.2 38.25,49.53 IC3.14
SCK  (via drill 0.3)
  Top 0.152: v57.61,55.17 63.09,55.17 68.73,49.53 68.73,47.7 66.75,45.72 66.75,43.43 67.21,42.98 67.51,42.98 68.58,44.04 70.26,44.04 IC1.20 | v55.93,55.78 53.19,58.52 EXP2.1
  Bottom 0.152: v57.61,55.17 57,55.78 v55.93,55.78 | IC3.8 38.25,34.29 54.1,50.14 54.1,56.84 53.19,57.76 53.19,58.52 EXP2.1
SCL  (via drill 0.3)
  Top 0.152: v59.89,50.6 59.89,48.77 IC1.43 | v64.47,55.17 64.47,55.93 61.87,58.52 61.87,58.83 60.66,60.05 60.35,60.05 59.59,60.81 59.59,61.57 57.76,63.4 51.05,63.4 48.92,61.27 23.32,61.27 22.4,62.18 IC3.22
  Bottom 0.152: v64.47,55.17 v59.89,50.6
SD_DETECT_1
  Top 0.152: SD_DETECT.1 59.44,4.42 57.15,4.42 48.31,13.26 SD_DETECT_OMC.1
SD_DETECT_2  (via drill 0.3)
  Top 0.152: v66.75,66.14 74.83,66.14 79.25,61.72 79.25,39.93 64.62,25.3 64.62,4.42 SD_DETECT.3
  Bottom 0.152: v66.75,66.14 62.64,62.03 62.64,61.87 61.87,61.11 61.87,60.66 60.66,59.44 60.66,58.67 EXP2.7
SDA  (via drill 0.3)
  Top 0.152: v55.63,49.99 58.83,49.99 59.28,49.53 59.28,48.77 IC1.44 | v54.56,48.92 42.67,48.92 38.25,53.34 33.07,53.34 v31.24,55.17
  Bottom 0.152: v54.56,48.92 v55.63,49.99 | v31.24,55.17 27.89,58.52 24.08,58.52 23.01,59.59 22.4,59.59 IC3.23
THERM0
  Top 0.152: IC1.84 60.2,32.61 60.2,27.28 48.92,16 44.96,16 43.59,14.63 24.23,14.63 22.4,16.46 IC3.40
THERM1  (via drill 0.3)
  Top 0.152: v58.37,26.67 59.44,27.74 59.44,28.19 59.28,28.35 59.28,32.61 IC1.82 | v57.15,25.45 53.95,25.45 43.43,14.94 26.52,14.94 22.4,19.05 IC3.39
  Bottom 0.152: v57.15,25.45 v58.37,26.67
THERM2
  Top 0.152: IC1.83 59.74,32.61 59.74,27.28 58.52,26.06 54.1,26.06 43.28,15.24 28.65,15.24 22.4,21.49 IC3.38
THERM3  (via drill 0.3)
  Top 0.152: T3.2 12.8,6.71 14.48,8.38 15.7,8.38 15.85,8.23 18.14,8.23 C5.+ 18.29,8.23 19.51,8.23 21.95,10.67 25.3,10.67 R4.2 | v45.11,15.39 48.77,15.39 60.81,27.43 60.81,32.61 IC1.85
  Bottom 0.152: v45.11,15.39 38.71,8.99 27.89,8.99 26.06,10.82 25.45,10.82 R4.2
TX  (via drill 0.3)
  Top 0.152: v48.01,61.87 49.07,61.87 51.82,64.62 74.98,64.62 78.33,61.27 78.33,42.82 71.17,35.66 70.41,35.66 IC1.3
  Bottom 0.152: v48.01,61.87 38.25,52.12 37.64,52.12 IC3.15
VCC  (via drill 0.3)
  Top 0.152: 61.42,41.76 59.13,41.76 | 59.13,41.76 54.41,41.76 IC1.61 54.25,41.76 52.27,41.76 52.12,41.6 v40.69,41.6 | 61.42,41.76 65.68,46.02 65.68,48.62 IC1.31 | v60.35,37.19 58.37,35.2 58.37,32.77 IC1.80 | 59.13,41.76 v59.13,38.41 | 61.42,41.76 64.62,38.56 65.08,38.56 65.68,39.17 70.26,39.17 IC1.10 70.41,39.17 71.02,39.17 71.17,39.01 72.54,39.01 78.03,44.5 78.03,58.98 77.11,59.89 77.11,60.96 EXP1.10
  Bottom 0.152: v59.13,38.41 v60.35,37.19 | v40.69,41.6 38.56,39.47 37.64,39.47 IC3.10
X-MIN
  Top 0.152: IC1.7 70.26,37.64 64.92,37.64 62.64,39.93 61.42,39.93 56.54,35.05 56.54,34.59 46.02,24.08 46.02,18.9 43.74,16.61 37.64,16.61 IC3.1
XD  (via drill 0.3)
  Top 0.152: v60.5,33.98 65.68,33.98 66.29,33.38 66.29,32.77 IC1.96 | v49.68,28.5 43.43,28.5 41.15,30.79 23.32,30.79 22.4,31.7 IC3.34
  Bottom 0.152: v60.5,33.98 55.02,28.5 v49.68,28.5
XS  (via drill 0.3)
  Top 0.152: v49.53,15.39 50.29,15.39 66.75,31.85 66.75,32.61 IC1.97 | v44.2,18.44 38.86,18.44 38.56,18.14 33.38,18.14 22.4,29.11 IC3.35
  Bottom 0.152: v49.53,15.39 46.48,18.44 v44.2,18.44
XTAL1
  Top 0.152: IC1.34 64.31,48.62 64.31,45.11 61.72,42.52 60.66,42.52 54.86,48.31 38.86,48.31 37.64,47.09 IC3.13
XTAL2
  Top 0.152: IC1.33 64.77,48.77 64.77,49.53 61.87,52.43 59.59,52.43 57,55.02 57,61.27 56.08,62.18 50.29,62.18 48.77,60.66 33.07,60.66 30.02,57.61 30.02,46.79 31.7,45.11 36.88,45.11 37.49,44.5 IC3.12
Y-MIN  (via drill 0.3)
  Top 0.152: v47.85,36.12 51.82,40.08 54.25,40.08 IC1.64 | v41.45,29.72 41.45,22.86 37.64,19.05 IC3.2
  Bottom 0.152: v41.45,29.72 v47.85,36.12
YD  (via drill 0.3)
  Top 0.152: v50.14,16 61.11,26.98 61.11,29.87 61.57,30.33 61.72,30.33 63.25,31.85 63.25,32.61 IC1.90 | v45.41,19.05 44.81,18.44 44.81,18.29 44.35,17.83 31.24,17.83 22.4,26.67 IC3.36
  Bottom 0.152: v50.14,16 47.09,19.05 v45.41,19.05
YS  (via drill 0.3)
  Top 0.152: v61.72,29.72 63.7,31.7 63.7,32.61 IC1.91 | v42.22,17.22 38.71,17.22 38.41,17.53 28.96,17.53 22.4,24.08 IC3.37
  Bottom 0.152: v61.72,29.72 59.28,27.28 55.02,27.28 47.4,19.66 44.65,19.66 v42.22,17.22
Z-MIN  (via drill 0.3)
  Top 0.152: v58.22,46.18 58.22,48.62 IC1.46 | v52.43,39.47 51.97,39.47 48.01,35.51 34.75,35.51 v34.44,35.81
  Bottom 0.152: v58.22,46.18 58.22,45.26 v52.43,39.47 | v34.44,35.81 34.44,23.93 36.73,21.64 37.49,21.64 IC3.3
ZD  (via drill 0.3)
  Top 0.152: v57.15,53.8 58.83,52.12 60.66,52.12 63.25,49.53 63.25,48.77 IC1.36 | v55.93,55.02 50.6,55.02 47.55,58.06 34.44,58.06 v34.29,57.91
  Bottom 0.152: v55.93,55.02 v57.15,53.8 | v34.29,57.91 34.29,57.61 34.59,57.3 34.59,50.14 30.63,46.18 24.38,46.18 23.93,46.63 23.62,46.63 23.32,46.94 22.4,46.94 IC3.28
ZS  (via drill 0.3)
  Top 0.152: v53.49,52.43 54.41,51.51 60.2,51.51 62.18,49.53 62.18,48.77 IC1.38 | v41.45,39.32 39.47,39.32 38.56,38.41 28.35,38.41 22.4,44.35 IC3.29
  Bottom 0.152: v53.49,52.43 53.49,51.36 v41.45,39.32

### Text on the board
tNames: C Fan 2 | C Fan 1 | C Fan 0 | Ex Fan | OMC | Display | OMC | Display